# Altium project EvaluationBoard_NanEyeC_BackScatter.PrjPcb
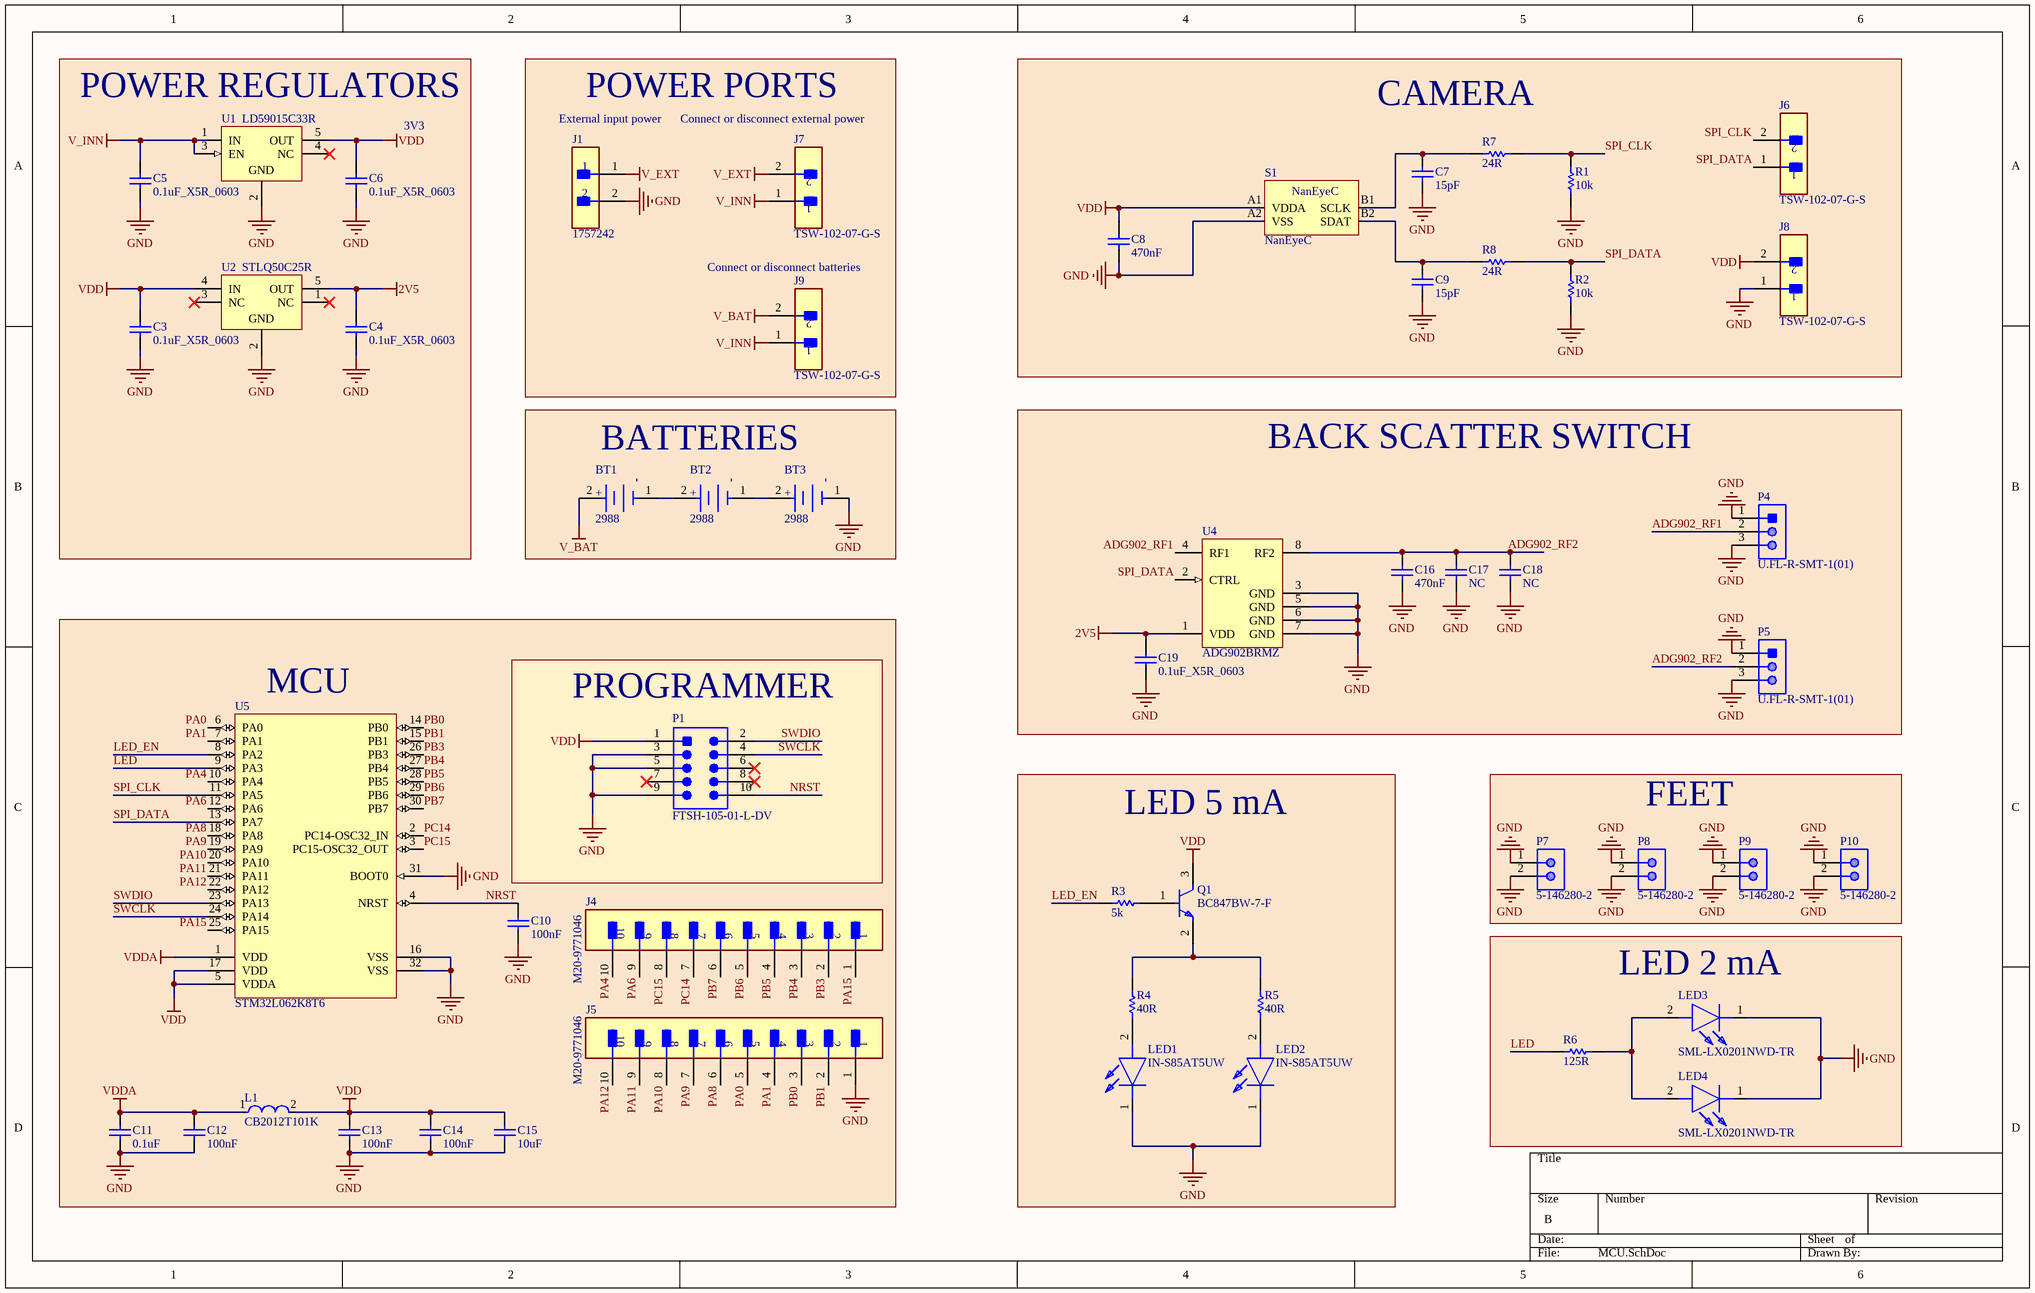
[diagram p0: MCU.SchDoc]
author: Simen Håbet Ødegård
1 sheet, 53 parts. Net scope: global (net labels, ports and power ports of the same name join across sheets).
Board file: PCB1.PcbDoc

## Sheet MCU.SchDoc
size B; SheetNumber: 1; SheetTotal: 1

### Parts
BT1  2988  [FP-2988-MFG]
BT2  2988  [FP-2988-MFG]
BT3  2988  [FP-2988-MFG]
C3  0.1uF_X5R_0603  [CAPC1608X90X35NL15T15]
C4  0.1uF_X5R_0603  [CAPC1608X90X35NL15T15]
C5  0.1uF_X5R_0603  [CAPC1608X90X35NL15T15]
C6  0.1uF_X5R_0603  [CAPC1608X90X35NL15T15]
C7  15pF  [CAPC1608X90X35NL15T15]
C8  470nF  [CAPC1608X90X35NL15T15]
C9  15pF  [CAPC1608X90X35NL15T15]
C10  100nF  [CAPC1608X90X35NL15T15]
C11  0.1uF  [CAPC1608X90X35NL15T15]
C12  100nF  [CAPC1608X90X35NL15T15]
C13  100nF  [CAPC1608X90X35NL15T15]
C14  100nF  [CAPC1608X90X35NL15T15]
C15  10uF  [CAPC1608X90X35NL15T15]
C16  470nF  [CAPC1608X90X35NL15T15]
C17  NC  [CAPC1608X90X35NL15T15]
C18  NC  [CAPC1608X90X35NL15T15]
C19  0.1uF_X5R_0603  [CAPC1608X90X35NL15T15]
J1  1757242  [FP-1757242-MFG]
J4  M20-9771046  [FP-M20-9771046-MFG]
J5  M20-9771046  [FP-M20-9771046-MFG]
J6  TSW-102-07-G-S  [FP-TSW-102-07-G-S-MFG]
J7  TSW-102-07-G-S  [FP-TSW-102-07-G-S-MFG]
J8  TSW-102-07-G-S  [FP-TSW-102-07-G-S-MFG]
J9  TSW-102-07-G-S  [FP-TSW-102-07-G-S-MFG]
L1  CB2012T101K  [FP-CB2012-MFG]
LED1  IN-S85AT5UW  [INS85AT5UW]
LED2  IN-S85AT5UW  [INS85AT5UW]
LED3  SML-LX0201NWD-TR  [LEDC0604X46N]
LED4  SML-LX0201NWD-TR  [LEDC0604X46N]
P1  FTSH-105-01-L-DV  [SMTC-FTSH-105-01-L-DV_V]
P4  U.FL-R-SMT-1(01)  [HRS-U.FL-R-SMT-3_V]
P5  U.FL-R-SMT-1(01)  [HRS-U.FL-R-SMT-3_V]
P7  5-146280-2  [TECO-5-146280-2_V]
P8  5-146280-2  [TECO-5-146280-2_V]
P9  5-146280-2  [TECO-5-146280-2_V]
P10  5-146280-2  [TECO-5-146280-2_V]
Q1  BC847BW-7-F  [FP-SOT323-MFG]
R1  10k  [RESC1608X50X30ML20T20]
R2  10k  [RESC1608X50X30ML20T20]
R3  5k  [RESC1608X50X30ML20T20]
R4  40R  [RESC1608X50X30ML20T20]
R5  40R  [RESC1608X50X30ML20T20]
R6  125R  [RESC1608X50X30ML20T20]
R7  24R  [RESC1608X50X30ML20T20]
R8  24R  [RESC1608X50X30ML20T20]
S1  NanEyeC  [NanEyeC]
U1  LD59015C33R  [SOT323-5L-L036_L]
U2  STLQ50C25R  [SOT323-5L_L]
U4  ADG902BRMZ  [ADI-RM-8_L]
U5  STM32L062K8T6  [STM-LQFP32_M]

### Blocks framed on the sheet
POWER REGULATORS: C3-C6 U1 U2
POWER PORTS: J1 J7 J9
CAMERA: C7-C9 J6 J8 R1 R2 R7 R8 S1
BATTERIES: BT1-BT3
BACK SCATTER SWITCH: C16-C19 P4 P5 U4
MCU: C10-C15 J4 J5 L1 U5
PROGRAMMER: P1
LED 5 mA: LED1 LED2 Q1 R3-R5
FEET: P7-P10
LED 2 mA: LED3 LED4 R6

### Nets
2V5: C4.2 C19.2 U2.5(OUT) U4.1(VDD)
GND: BT3.1(C) C3.1 C4.1 C5.1 C6.1 C7.1 C8.1 C9.1 C10.1 C11.1 C12.1 C13.1 C14.1 C15.1 C16.1 C17.1 C18.1 C19.1 J1.2 J5.1 J8.1 LED1.1(K) LED2.1(K) LED3.1(K) LED4.1(K) P1.3 P1.5 P1.9 P4.1 P4.3 P5.1 P5.3 P7.1 P7.2 P8.1 P8.2 P9.1 P9.2 P10.1 P10.2 R1.1 R2.1 S1.A2(VSS) U1.2(GND) U2.2(GND) U4.3(GND) U4.5(GND) U4.6(GND) U4.7(GND) U5.16(VSS) U5.31(BOOT0) U5.32(VSS)
V_BAT: BT1.2(A) J9.2
V_EXT: J1.1 J7.2
V_INN: C5.2 J7.1 J9.1 U1.1(IN) U1.3(EN)
VDD: C3.2 C6.2 C8.2 C13.2 C14.2 C15.2 J8.2 L1.2 P1.1 Q1.3(C) S1.A1(VDDA) U1.5(OUT) U2.4(IN) U5.5(VDDA) U5.17(VDD)
VDDA: C11.2 C12.2 L1.1 U5.1(VDD)
ADG902_RF1: P4.2 U4.4(RF1)
ADG902_RF2: C16.2 C17.2 C18.2 P5.2 U4.8(RF2)
LED: R6.2 U5.9(PA3)
LED_EN: R3.2 U5.8(PA2)
NRST: C10.2 P1.10 U5.4(NRST)
PA0: J5.5 U5.6(PA0)
PA1: J5.4 U5.7(PA1)
PA4: J4.10 U5.10(PA4)
PA6: J4.9 U5.12(PA6)
PA8: J5.6 U5.18(PA8)
PA9: J5.7 U5.19(PA9)
PA10: J5.8 U5.20(PA10)
PA11: J5.9 U5.21(PA11)
PA12: J5.10 U5.22(PA12)
PA15: J4.1 U5.25(PA15)
PB0: J5.3 U5.14(PB0)
PB1: J5.2 U5.15(PB1)
PB3: J4.2 U5.26(PB3)
PB4: J4.3 U5.27(PB4)
PB5: J4.4 U5.28(PB5)
PB6: J4.5 U5.29(PB6)
PB7: J4.6 U5.30(PB7)
PC14: J4.7 U5.2(PC14-OSC32_IN)
PC15: J4.8 U5.3(PC15-OSC32_OUT)
SPI_CLK: J6.2 R1.2 R7.1 U5.11(PA5)
SPI_DATA: J6.1 R2.2 R8.1 U4.2(CTRL) U5.13(PA7)
SWCLK: P1.4 U5.24(PA14)
SWDIO: P1.2 U5.23(PA13)
NetBT1_1: BT1.1(C) BT2.2(A)
NetBT2_1: BT2.1(C) BT3.2(A)
NetC7_2: C7.2 R7.2 S1.B1(SCLK)
NetC9_2: C9.2 R8.2 S1.B2(SDAT)
NetLED1_2: LED1.2(A) R4.1
NetLED2_2: LED2.2(A) R5.1
NetLED3_2: LED3.2(A) LED4.2(A) R6.1
NetQ1_1: Q1.1(B) R3.1
NetQ1_2: Q1.2(E) R4.2 R5.2

Not connected (* = marked no-connect by the designer): P1 6* 7* 8*; U1 4(NC)*; U2 1(NC)* 3(NC)*

### Notes on the sheet
- 3V3
- (near J1) External input power
- (near J7) Connect or disconnect external power
- Connect or disconnect batteries
- (in symbol CMP-19636-000008-1) -; +

### Library data of the parts
BT1-BT3 = CMP-19636-000008-1: BATTERY RETAINER COIN 7.9MM SMD; Number of Cells: 1; Mount: Surface Mount; Number of Batteries: 1; Package Quantity: 100; Termination: SMD/SMT; REACH SVHC: No SVHC; Case/Package: SMD/SMT
C3-C19 = CMP-2006-04463-1: Manufacturer: AVX Interconnect / Elco; Part Number: 06035D104KAT2A
J1 = CMP-09399-000010-1: TERM BLOCK HDR 2POS 90DEG 5.08MM; Number of Poles: 2; Voltage Rating (DC): 320V; Number of Levels: 1; Voltage Rating: 250V; Current: 15A; Gender: Male; Current Rating: 12A; Voltage: 300V; Approvals: UL; Connector Type: Plug; Package Quantity: 50; Weight: 5.396916oz; Mount: Through Hole; Lead Free: Lead Free; Depth: 12mm; Contact Plating: Tin; Housing Material: PBT; Color: Grey; REACH SVHC: No SVHC; Number of Contacts: 2; Flammability Rating: UL94 V-0; Length: 12.16mm; Housing Color: Green; RoHS Compliant: Yes; Contact Material: Tin; Height: 12.08mm; Orientation: Right Angle; Termination: Solder; Pitch: 5.08mm; Number of Positions: 2; Packaging: Bulk; Number of Rows: 1; Number of Positions Per Level: 2; Width: 12.1mm; Max Current Rating: 12A; Series: MSTBA
J4 J5 = CMP-15831-000029-1: CONN HEADER VERT 10POS 2.54MM; Gender: Male; Number of Positions: 10; Connector Type: Male Pin; Voltage Rating: 750V; Current Rating: 3A; Contact Plating: Tin; Mount: Through Hole; Radiation Hardening: No; Packaging: Bulk; Pitch: 2.54mm; Number of Rows: 1; Series: M20; Contact Type: Male Pin; Color: Black; Package Quantity: 500; Contact Mating Length: 0.228inch; Case/Package: SIL; Termination: Solder; Number of Contacts: 10; Housing Material: Nylon; Contact Material: Brass
J6-J9 = CMP-02766-000084-1: CONN HEADER VERT 2POS 2.54MM; Manufacturer: Samtec; Number Of Contacts: 2; Voltage Rating: 550V; Conn Orientation: Straight; Current Rating: 6.3A; Conn Gender: Male; Package: TSW-102-07-G-S; Digikey Description: CONN HEADER VERT 2POS 2.54MM; ComponentLink2URL: http://suddendocs.samtec.com/catalog_english/tsw_th.pdf; Height: 8.71mm; Temperature: -55°C to +125°C; Device Class L2: Headers and Wire Housings; ComponentLink2Description: Datasheet; Device Class L3: unset; Contact Material: Gold,Nickel; Temperature Range Low: -55°C; Temperature Range High: +125°C; RoHS: TRUE; Device Class L1: Connectors; Mouser Description: Conn Unshrouded Header HDR 2 POS 2.54mm Solder ST Thru-Hole Automotive Bulk; Number Of Rows: 1; Category: Conn; Pitch: 2.54mm; Lead Free: Yes; Automotive: No; Manufacturer Part Number: TSW-102-07-G-S; Footprint Url: http://suddendocs.samtec.com/prints/tsw-xxx-xx-x-x-xx-xxx-footprint.pdf; Octopart: https://octopart.com/tsw-102-07-g-s-samtec-272197
L1 = CMP-14484-000220-1: SMD Inductors 100uH ±10% 0.13A 9.1Ω 0805; Shielding: Unshielded; Self Resonant Frequency: 8MHz; Saturation Current: 60mA; Core Material: Ferrite; Max DC Current: 130mA; Test Frequency: 796kHz; DC Resistance (DCR): 9.1R; Length: 0.079inch; Min Operating Temperature: -40°C; Termination: SMD/SMT; Series: CB; Inductance: 100uH; Tolerance: 10%; Height - Seated (Max): 0.057inch; Package Quantity: 3000; Radiation Hardening: No; Mount: Surface Mount; Case Code (Metric): 2012; Max Operating Temperature: 105°C; Packaging: Tape and Reel; Width: 0.049inch; RoHS Compliant: Yes; Resistor Type: Wirewound; Halogen Free: Halogen Free; Case Code (Imperial): 0805; Depth: 1.45mm; Inductance Tolerance: 10%; Number of Pins: 2; Height: 0.9mm; Current Rating: 130mA; Lead Free: Lead Free; Case/Package: 0805
LED1 LED2 = IN-S85AT5UW: LED; Manufacturer_Name: Inolux; Datasheet Link: http://www.inolux-corp.com/datasheet/SMDLED/Mono%20Color%20Top%20View/IN-S85AT%20Series_V1.1.pdf; Height: 1.1mm; Manufacturer_Part_Number: IN-S85AT5UW; Mouser Part Number: 743-IN-S85AT5UW; Mouser Price/Stock: https://www.mouser.co.uk/ProductDetail/Inolux/IN-S85AT5UW?qs=fAHHVMwC%252BbgX8qoUxtYjNQ%3D%3D; Arrow Part Number: IN-S85AT5UW; Arrow Price/Stock: https://www.arrow.com/en/products/in-s85at5uw/inolux-corporation
LED3 LED4 = SML-LX0201NWD-TR: LED; Manufacturer_Name: Lumex; Datasheet Link: https://componentsearchengine.com//SML-LX0201NWD-TR.pdf; Height: 0.46mm; Mouser2 Part Number: 696-SMLLX0201NWDTR; Mouser2 Price/Stock: https://www.mouser.com/Search/Refine.aspx?Keyword=696-SMLLX0201NWDTR; Manufacturer_Part_Number: SML-LX0201NWD-TR
P1 = CMP-2000-05354-1: Male Header, Pitch 1.27 mm, 2 x 5 Position, Height 5.96 mm, -55 to 125 degC, RoHS, Bulk; Manufacturer: Samtec; Connector Type: Header,Unshrouded; Pitch: 0.050"(1.27mm); Mating Products: FLE-105-01-G-DV-TR-ND-CONNSKT1.27MM10POSDUALSMDCLP-105-02-G-D-P-TR-ND-CONNRCPT10POSDUAL.05"SMDSFMC-105-L2-S-D-TR-ND-CONN.05"SURFACE10POSSMTSFMH-105-02-L-D-TR-ND-CONNRECEPT10POS.50"SMTFLE-105-01-G-DV-A-ND-CONNSKT1.27MM10POSDUALSMDCLP-105-02-G-D-BE-ND-CONNRCPT10POSDUAL.05"SMDFLE-105-01-G-DV-A-P-ND-CONNSKT1.27MM10POSDUALSMDSAM1153-05-ND-CONNRCPT10POSDUAL.05"SMDSAM1155-05-ND-CONNRCPT10POSDUAL.05"SMDSAM1154-05-ND-CONNRCPT10POSDUAL.05"SMDSFMH-105-02-L-D-LC-ND-CONNRECEPT10POS.50"SMTSAM1226-05-ND-CONNRCPT.05"10POSDUALSMD; Catalog Drawings: FTSHSeriesFTSHSeriesSMTSide; Other Names: SAM1161-05; EDA / CAD Models: DownloadfromAcceleratedDesigns; Number of Positions Loaded: All; Number of Positions: 10; Featured Product: Board-To-BoardInterconnectSystems; Online Catalog: FTSHSeries; Product Training Modules: Board-to-BoardConnectors; Category: Connectors,Interconnects; Number of Rows: 2; Contact Finish: Gold; Termination: Solder; Mounting Type: SurfaceMount; Series: FTSH; Contact Mating Length: 0.120"(3.05mm); Row Spacing: 0.050"(1.27mm); Datasheet URL: https://datasheet.ciiva.com/30493/0900766b80adfe36-30493006.pdf; Contact Finish Thickness: 10µin(0.25µm); Features: -; Standard Package: 1; Packaging: Bulk; Datasheet Version: Feb-08; Manufacturer URL: http://www.samtec.com/; Fastening Type: -; Family: RectangularConnectors-Headers,MalePins; Contact Type: MalePin; Color: Black
P4 P5 = CMP-2000-05153-1: Ultra Small Coaxial Connector, 6 GHz, -40 to 90 degC, 3-Pin SMD, RoHS, Bulk; Manufacturer: Hirose Electric; Connector Style: U.FL; Impedance: 50Ohm; Dielectric Material: LiquidCrystalPolymer(LCP); Minimum Quantity: UltraMiniatureCoaxial; Online Catalog: U.FLSeries; Featured Product: HiroseU.FLSeries; Frequency - Max: 6GHz; Other Names: H122041 / U.FL-R-SMT-1(01)-ND; Contact Termination: Solder; Body Material: PhosphorBronze; Connector Type: Jack,MalePin; Body Finish: Silver; Center Contact Plating: Gold; Manufacturer URL: https://www.hirose.com; Family: CoaxialConnectors(RF); Fastening Type: Snap-On; Unit PriceUSD: U.FL; Series: U.FL; Package Reference: U.FL-R-SMT; Packaging: Bulk; Standard Package: 100; Mounting Type: SurfaceMount; Quantity Available: Bulk; Housing Color: Silver; Package Description: 3-Pin Surface Mount Device, Body 2.6 x 2.6 mm; Category: Connectors,Interconnects; Operating Temperature: -40degC~90degC; Center Contact Material: PhosphorBronze; Dynamic Catalog: U.FLSeries; Datasheet URL: https://datasheet.ciiva.com/26945/getdatasheetpartid-475239-26945414.pdf; Datasheet Version: Feb-09; Shield Termination: Solder
P7-P10 = CMP-2000-07492-1: Male Header, Pitch 2.54 mm, 1 x 2 Position, Height 8.21 mm, Tail Length 3.05 mm, -65 to 105 degC, RoHS, Bulk; Manufacturer: TE Connectivity; Mating Connector Lock: No(Without); Number of Positions: 2; Pitch: 2.54mm; PCB Mounting Orientation: Vertical; Keyed: No; Case\/Package: 100; Mating Post Length: 0.23inch; High Temperature Housing: Yes; Max Current Rating: 5A; PCB Thickness: 0.063inch; PCB Mount Retention: Without; Approvals: CSA; Current Rating: 3A; Radiation Hardening: No; Length: 4.67mm; Contact Mating Length: 0.23inch; Connector Type: Header; Number of Rows: 1; Termination Post Length: 0.12inch; Board Standoff: No(Without); Max Operating Temperature: 105degC; Contact Shape: Square; Selectively Loaded: No(Without); Gasket: No(Without); Number of Contacts: 2; Contact Gender: Male; Mating Alignment: No(Without); Manufacturer URL: http://www.te.com/; Datasheet URL: http://www.te.com/commerce/DocumentDelivery/DDEController?Action=showdoc&DocId=Customer+Drawing%7F146280%7FH1%7Fpdf%7FEnglish%7FENG_CD_146280_H1.pdf%7F5-146280-2; Mount: ThroughHole; Orientation: Straight; Packaging: Carton; Package Reference: 5-146280-2; Package Quantity: 500; Stabilizers: No(Without); Row Spacing: 2.54mm; Contact Material: CopperAlloy; Panel Mount Retention: No(Without); Datasheet Version: Rev. H1, 08/2016; Housing Colour: Black; Colour: Black; Package Description: Male Header, Pitch 2.54 mm, 1 x 2 Position, Height 8.21 mm, Tail Length 3.05 mm; Contact Plating: Matte; Housing Material: Polymer; Contact Protection: No(Without); Min Operating Temperature: -65degC; Mounting Technology: ThroughHole; Flammability Rating: UL94V-0; RoHSCompliant: true; Termination: ThroughHole; Depth: 2.34mm; High Speed Serial Data Connector: No
Q1 = CMP-12798-000012-1: TRANS NPN 45V 0.1A SC70-3; Manufacturer: Diodes Inc; Unity Gain Freq: 300MHz; Number Of Elements: 1; Max Collector Current: 100mA; Rthja Max: 625°C/W; Power Dissipation: 200mW; Hfe Testic: 2mA; Max Junction Temp: +150°C; Collector Base Voltage: 50V; Hfe Testvce: 5V; Collector Emitter Saturation Voltage: 200mV; Hfe Min: 200; Automotive Grade: Grade 0; Emitter Base Voltage: 6V; Hfe Max: 450; Standoff Height: 0mm; Footprint Url: https://www.diodes.com/assets/Package-Files/SOT323.pdf; Temperature: -65°C to +150°C; Octopart: https://octopart.com/bc847bw-7-f-diodes+inc.-354380; Device Class L2: Transistors; Device Class L3: BJTs; Digikey Description: TRANS NPN 45V 0.1A SC70-3; Temperature Range Low: -65°C; Temperature Range High: +150°C; ComponentLink2Description: Datasheet; Height: 1.1mm; Number Of Npn: 1; Automotive: Yes; Collector Emitter Voltage: 45V; Category: Trans; Manufacturer Part Number: BC847BW-7-F; Ipc Land Pattern Name: SOT65P210X100-3; Device Class L1: Discrete Semiconductors; Mouser Description: Bipolar Transistors - BJT BIPOLAR TRANSISTOR NPN SOT-323; ComponentLink2URL: https://www.diodes.com/assets/Datasheets/ds30250.pdf; Lead Free: Yes; Package: SOT323; RoHS: TRUE; Collector Emitter Breakdown Voltage: 45V
R1-R8 = CMP-2000-02665-1: Part Number: RR0816P-4640-D-65A; Manufacturer: Susumu
S1 = NanEyeC: Camera module NanEyeC from AMS. The Part will be delivered by us
U1 = CMP-0244-00349-1: 150 mA Low Noise High PSRR linear Voltage Regulator, 3.3V, 5-Pin SOT-323, Tape and Reel; PackageDescription: 5-Pin SOT-323 Package, 2 x 1.3 mm Body, 0.65 mm Pitch, 2.1 mm Lead Span; ComponentLink2Description: Datasheet; PackageReference: SOT323-5L-L036; ComponentLink1Description: Manufacturer URL; ComponentLink2URL: http://www.st.com/internet/com/TECHNICAL_RESOURCES/TECHNICAL_LITERATURE/DATASHEET/CD00273252.pdf; DatasheetVersion: 1/12/2011; ComponentLink1URL: http://www.st.com; PackageVersion: 1/01/2011
U2 = CMP-0244-00360-1: 50mA, 3µA Supply Current Low Drop Linear Regulator, 2.5V, 5-Pin SOT-323, Tape and Reel; ComponentLink2Description: Datasheet; PackageReference: SOT323-5L; DatasheetVersion: 1/11/2007; PackageVersion: 1/01/2006; ComponentLink1URL: http://www.st.com; ComponentLink2URL: http://www.st.com/internet/com/TECHNICAL_RESOURCES/TECHNICAL_LITERATURE/DATASHEET/CD00151464.pdf; PackageDescription: 5-Pin SOT-323 Package, 2 x 1.3 mm Body, 0.65 mm Pitch, 2.1 mm Lead Span; ComponentLink1Description: Manufacturer URL
U4 = CMP-0290-00054-1: RF Switch, Wideband, 40 dB Isolation at 1 GHz, CMOS 1.65 V to 2.75 V, SPST Switches, RM-8, Pb-Free, 50 Tube; Configuration: SPST/NO; Off Isolation: 37dB; # Sw Functions: 1; P-1dB (dBm): 17; Supply Voltage: Single (+1.65V to +2.75V); Off Isolation Test Freq: 1G; Insertion Loss (dB): 800mdB; Bandwidth: 4.5GHz; ComponentLink1URL: www.analog.com; ComponentLink2URL: http://www.analog.com/static/imported-files/data_sheets/ADG901_902.pdf; ComponentLink3URL: http://www.analog.com/static/imported-files/packages/PKG_PDF/MSOP%28RM%29/RM_8.pdf; ComponentLink1Description: Manufacturer URL; PackageVersion: Aug-2005; PackageDescription: 8-Lead Mini Small Outline Package [MSOP]; ComponentLink3Description: Package Specification; ComponentLink2Description: Datasheet; PackageReference: RM-8; DatasheetVersion: RevB; Code_JEDEC: MO-187-AA
U5 = CMP-1546-00066-1: Ultra-Low-Power ARM Cortex-M0+ MCU, 64 KB Flash, 8 KB Internal RAM, 27 I/Os, 32-Pin LQFP, -40 to 85 degC, Tray; Internal RAM Size (kB): 8; I/Os (High Current): 27; D/A Converter: 1; Operating Frequency(F) (Processor speed) (MHz): 32; Supply Voltage(Vcc) min (V): 1.65; FLASH Size (Prog) (kB): 64; Data E2PROM nom (B): 2048; ComponentLink2Description: Datasheet; DatasheetVersion: Rev. 7; ComponentLink2URL: http://www.st.com/st-web-ui/static/active/en/resource/technical/document/datasheet/DM00108218.pdf; Core: ARM Cortex-M0+; Package Reference: LQFP32; ComponentLink1Description: Manufacturer URL; Package Description: 32-Pin Low Profile Quad Flat Package, 7 x 7 mm Body, 0.8 mm Pitch; Mounting Technology: Surface Mount; ComponentLink1URL: http://www.st.com/; Packing: Tray